# EasyEDA schematic perchi velik_2021-06-24.json
TITLE: Sheet_1; REV: 1.0; Date: 2020-06-29; Sheet: 1/1; Drawn By: lskshatura97; Company: Your Company
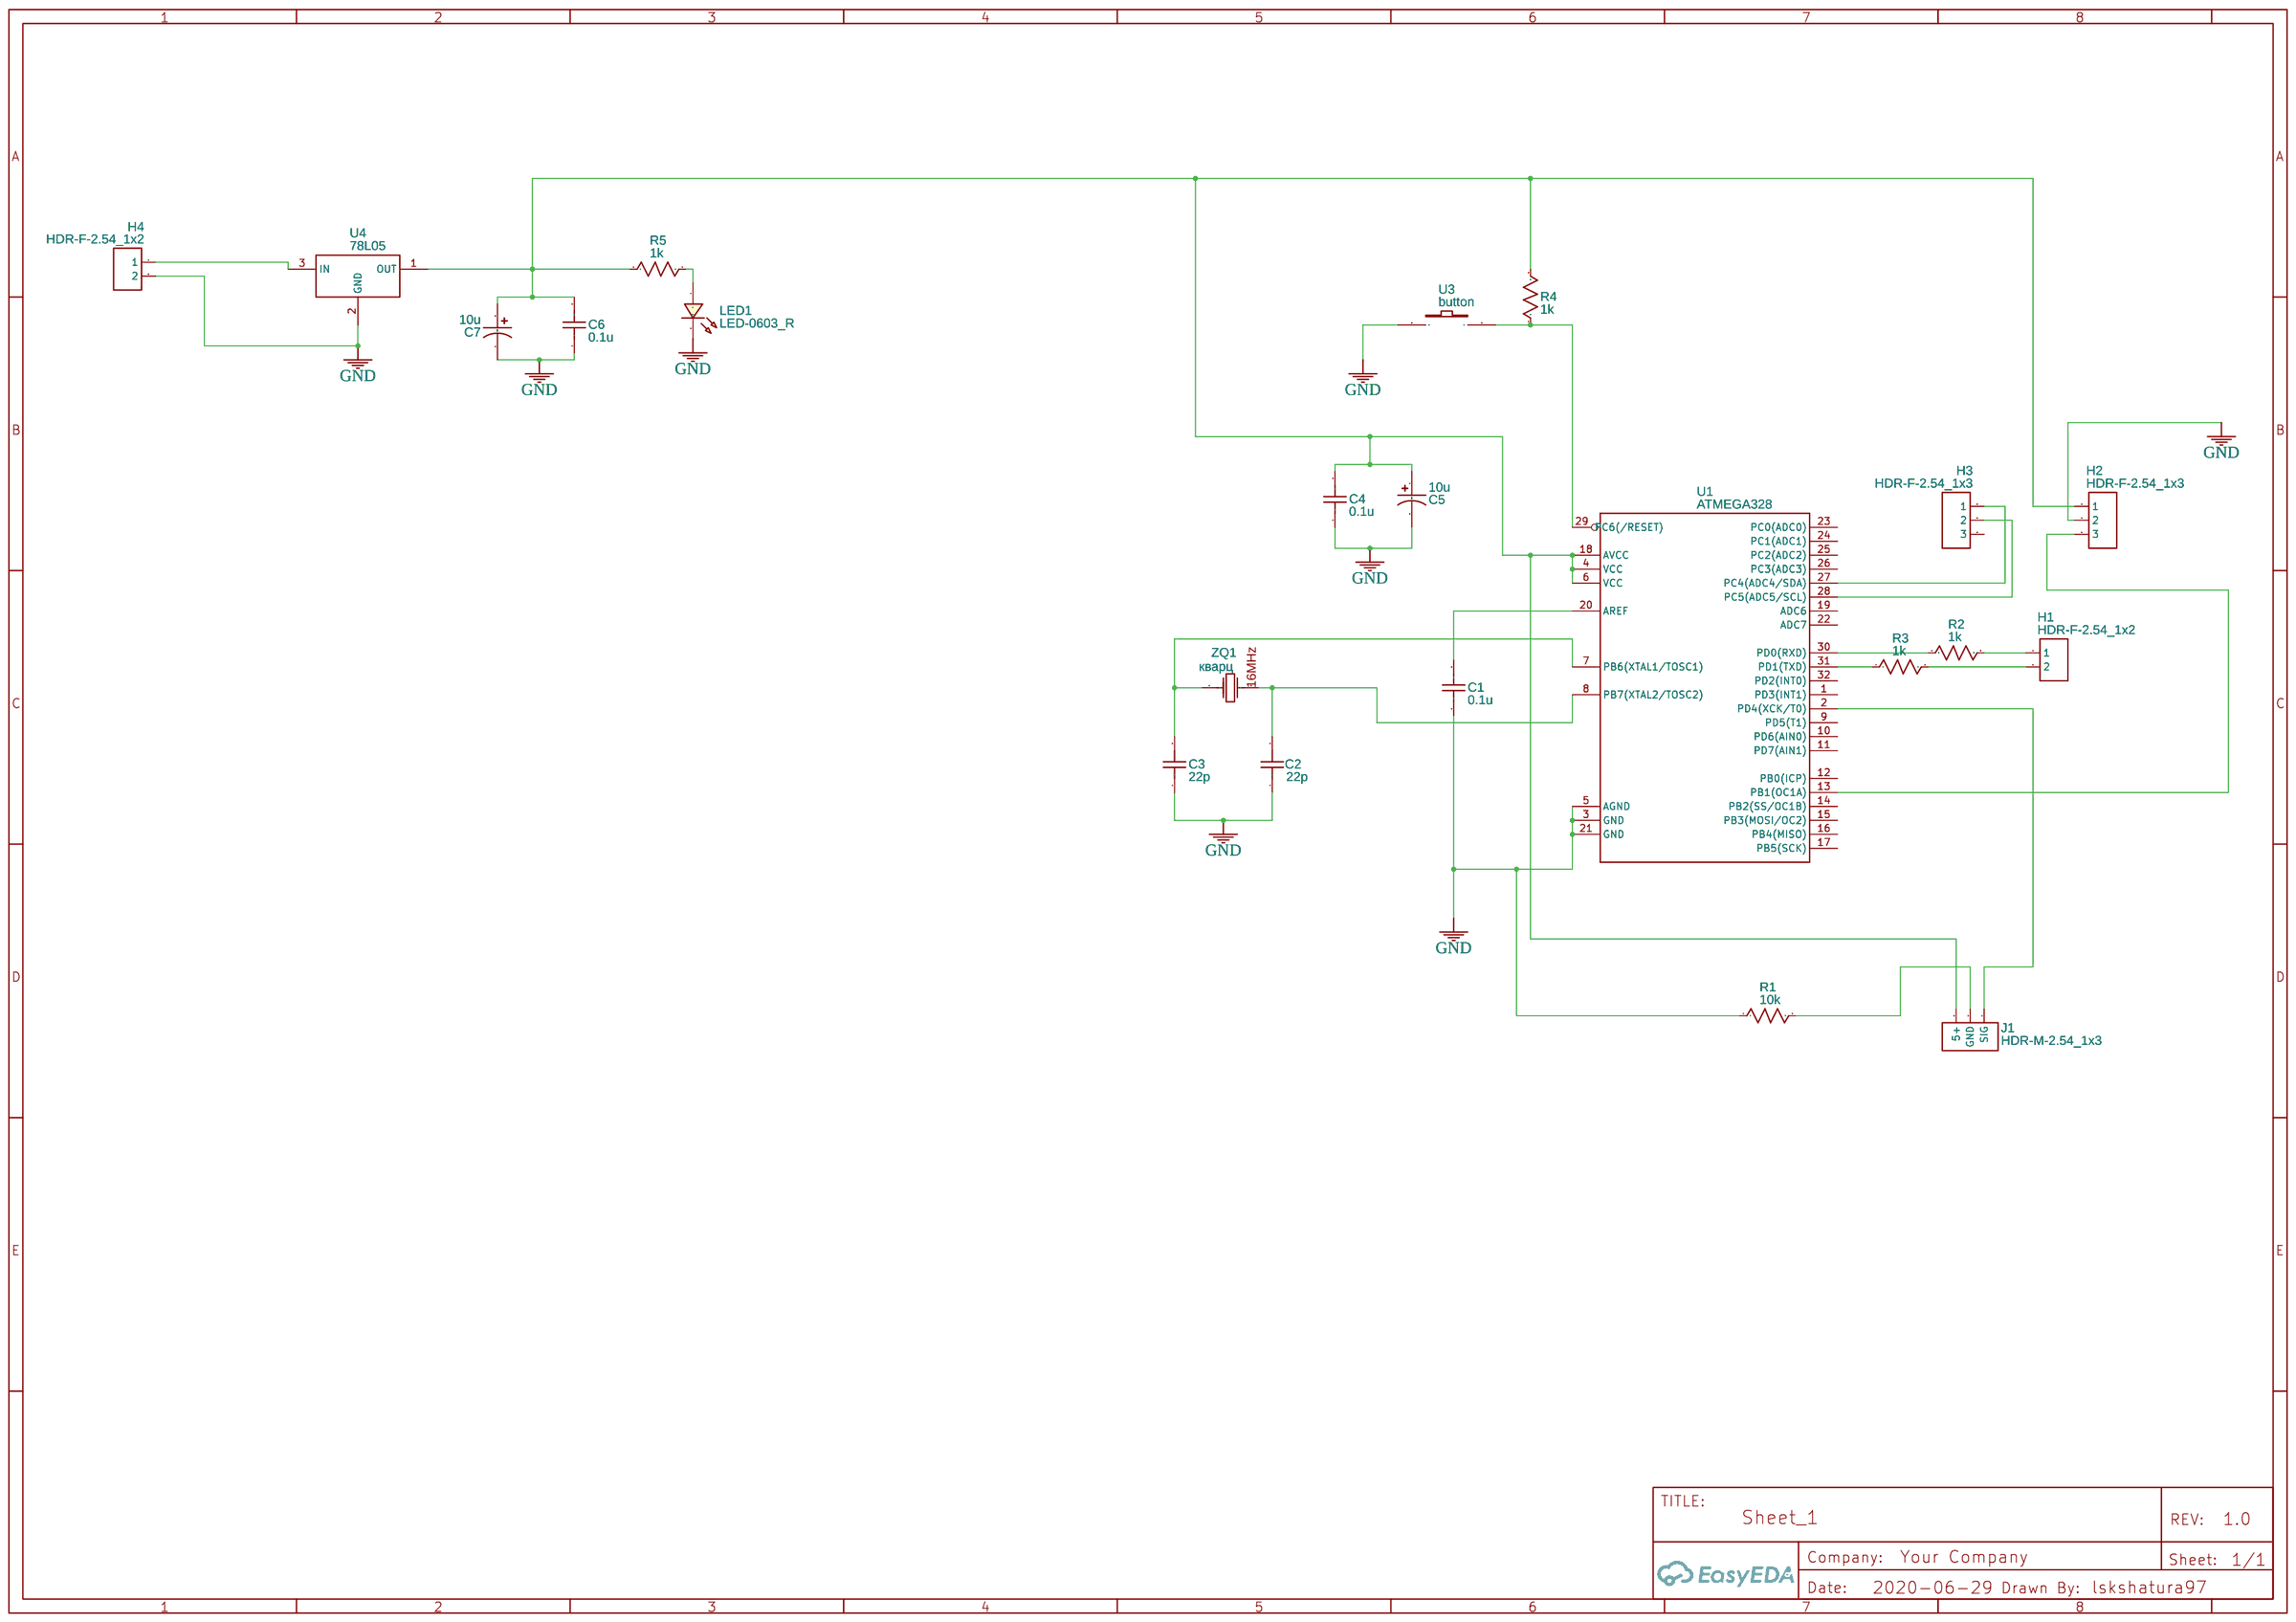
[diagram p0: schematic sheet]

## Parts
C1  0.1u  [C0201]
C2  22p  [C0201]
C3  22p  [C0201]
C4  0.1u  [C0201]
C5  10u  [CASE-A_3216]
C6  0.1u  [C0201]
C7  10u  [CASE-A_3216]
H1  HDR-F-2.54_1x2  [HDR-F-2.54_1X2]
H2  HDR-F-2.54_1x3  [HDR-F-2.54_1X3]
H3  HDR-F-2.54_1x3  [HDR-F-2.54_1X3]
H4  HDR-F-2.54_1x2  [HDR-F-2.54_1X2]
J1  HDR-M-2.54_1x3  [HDR-M-2.54_1X3]
LED1  LED-0603_R  [LED0603_RED]
R1  10k  [R0201]
R2  1k  [R0201]
R3  1k  [R0201]
R4  1k  [R0201]
R5  1k  [R0201]
U1  ATMEGA328  [TQFP32-08]
U3  button  [BUTTON]
U4  78L05  [SOT-89-3_L4.5-W2.5-P1.50-LS4.2-BR]
ZQ1  кварц  [OSC-SMD_2P-L4.9-W1.8]

## Library data of the parts
C1-C4 C6 = C_0201_US: Contributor: LCEDA_Lib
C5 C7 = C_Tan_SMD_A_US: Contributor: LCEDA_Lib
H1 H4 = HDR-F-2.54_1x2: Supplier Part: C49661; Supplier: LCSC; Contributor: LCEDA_Lib
H2 H3 = HDR-F-2.54_1x3: Supplier Part: C146690; Supplier: LCSC; Contributor: LCEDA_Lib
J1 = HDR-M-2.54_1x3: Supplier Part: C180248; Supplier: LCSC; Contributor: LCEDA_Lib
LED1 = LED-0603_R: Manufacturer: EVERLIGHT(台湾亿光); Manufacturer Part: 19-217/R6C-AL1M2VY/3T; Supplier Part: C72044; Supplier: LCSC; Contributor: LCEDA_01
R1-R5 = R_0201_US: Contributor: LCEDA_Lib
U1 = ATMEGA328: Contributor: luca_isinnova
U3 = button: Contributor: speedlao
U4 = 78L05: Supplier: LCSC; Manufacturer: SK; Supplier Part: C112446; LCSC Assembly: Yes; SMT Type: Extend
ZQ1 = кварц: Contributor: rtfx_echo

## Nets
GND: C1.1 C2.1 C3.1 C4.1 C5.2 C6.1 C7.2 H2.2 H4.2 LED1.2 R1.1 U1.3(GND) U1.5(AGND) U1.21(GND) U3.1 U4.2(GND)
Net-(C1-2): C1.2 U1.20(AREF)
Net-(C2-2): C2.2 U1.8(PB7(XTAL2/TOSC2)) ZQ1.2(OSC2)
Net-(C3-2): C3.2 U1.7(PB6(XTAL1/TOSC1)) ZQ1.1(OSC1)
Net-(C4-2): C4.2 C5.1 C6.2 C7.1 H2.1 J1.3(5+) R4.2 R5.1 U1.4(VCC) U1.6(VCC) U1.18(AVCC) U4.1(OUT)
Net-(H1-1): H1.1 R2.2
Net-(H1-2): H1.2 R3.2
Net-(H2-3): H2.3 U1.13(PB1(OC1A))
Net-(H3-1): H3.1 U1.27(PC4(ADC4/SDA))
Net-(H3-2): H3.2 U1.28(PC5(ADC5/SCL))
Net-(H4-1): H4.1 U4.3(IN)
Net-(J1-1): J1.1(SIG) U1.2(PD4(XCK/T0))
Net-(J1-2): J1.2(GND) R1.2
Net-(LED1-1): LED1.1 R5.2
Net-(R2-1): R2.1 U1.30(PD0(RXD))
Net-(R3-1): R3.1 U1.31(PD1(TXD))
Net-(R4-1): R4.1 U1.29(PC6(/RESET)) U3.2

Not connected (* = marked no-connect by the designer): H3 3; U1 1(PD3(INT1)) 9(PD5(T1)) 10(PD6(AIN0)) 11(PD7(AIN1)) 12(PB0(ICP)) 14(PB2(SS/OC1B)) 15(PB3(MOSI/OC2)) 16(PB4(MISO)) 17(PB5(SCK)) 19(ADC6) 22(ADC7) 23(PC0(ADC0)) 24(PC1(ADC1)) 25(PC2(ADC2)) 26(PC3(ADC3)) 32(PD2(INT0))
